# Altium schematic sheet mcu.SchDoc
size A4; SheetNumber: 2; SheetTotal: 4
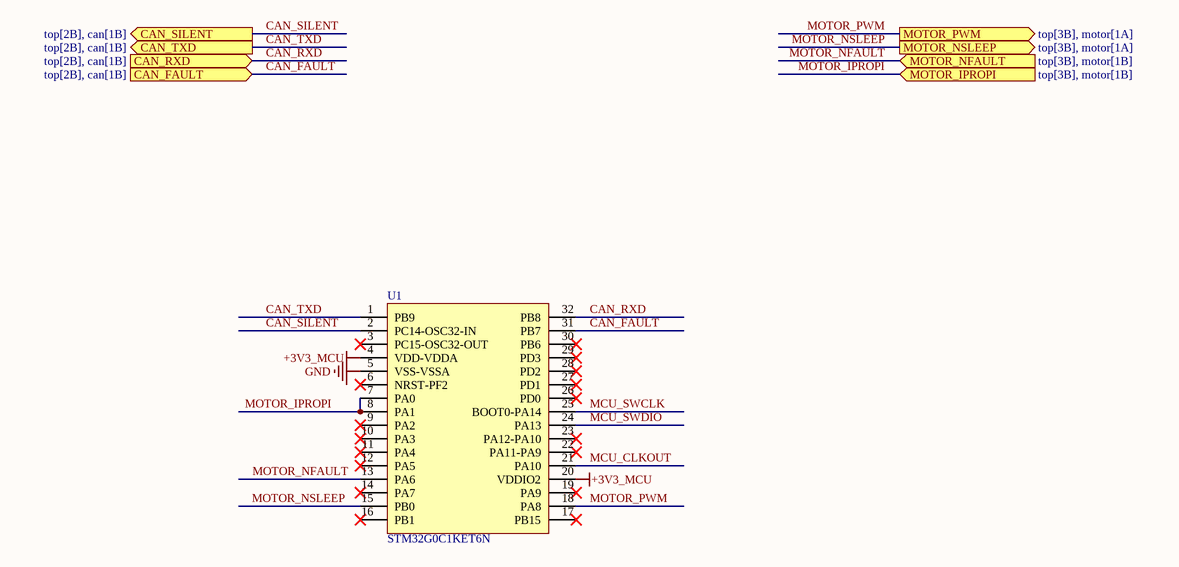
[diagram p0: mcu.SchDoc]

## Parts
U1  STM32G0C1KET6N  [STM32G0C1KET6N]

## Ports
CAN_FAULT (in, see top[2B], can[1B]), CAN_RXD (in, see top[2B], can[1B]), CAN_SILENT (out, see top[2B], can[1B]), CAN_TXD (out, see top[2B], can[1B]), MOTOR_IPROPI (in, see top[3B], motor[1B]), MOTOR_NFAULT (in, see top[3B], motor[1B]), MOTOR_NSLEEP (out, see top[3B], motor[1A]), MOTOR_PWM (out, see top[3B], motor[1A])

## Nets
+3V3_MCU: U1.4(VDD-VDDA) U1.20(VDDIO2)
GND: U1.5(VSS-VSSA)
CAN_FAULT: U1.31(PB7) ; port CAN_FAULT
CAN_RXD: U1.32(PB8) ; port CAN_RXD
CAN_SILENT: U1.2(PC14-OSC32-IN) ; port CAN_SILENT
CAN_TXD: U1.1(PB9) ; port CAN_TXD
MCU_CLKOUT: U1.21(PA10)
MCU_SWCLK: U1.25(BOOT0-PA14)
MCU_SWDIO: U1.24(PA13)
MOTOR_IPROPI: U1.7(PA0) U1.8(PA1) ; port MOTOR_IPROPI
MOTOR_NFAULT: U1.13(PA6) ; port MOTOR_NFAULT
MOTOR_NSLEEP: U1.15(PB0) ; port MOTOR_NSLEEP
MOTOR_PWM: U1.18(PA8) ; port MOTOR_PWM

Not connected (* = marked no-connect by the designer): U1 3(PC15-OSC32-OUT)* 6(NRST-PF2)* 9(PA2)* 10(PA3)* 11(PA4)* 12(PA5)* 14(PA7)* 16(PB1)* 17(PB15)* 19(PA9)* 22(PA11-PA9)* 23(PA12-PA10)* 26(PD0)* 27(PD1)* 28(PD2)* 29(PD3)* 30(PB6)*

## Library data of the parts
U1 = STM32G0C1KET6N: STM32 MCU; Supplier 1: Mouser; Supplier Part Number 1: 511-STM32G0C1KET6